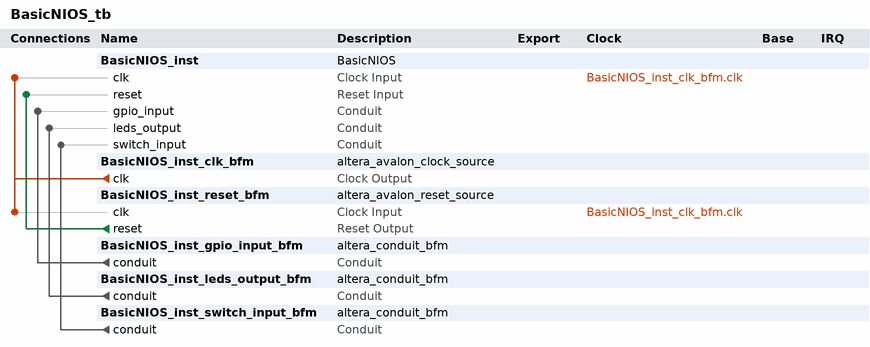
[diagram p0: system contents]
# Platform Designer (Qsys) system BasicNIOS_tb, Cyclone V 5CSEMA5F31C6
# Parameters at their usual value, and those the tool derives, are not listed.
package require -exact qsys 18.1
create_system BasicNIOS_tb
set_project_property DEVICE_FAMILY {Cyclone V}
set_project_property DEVICE 5CSEMA5F31C6

add_instance BasicNIOS_inst BasicNIOS 1.0

add_instance BasicNIOS_inst_clk_bfm altera_avalon_clock_source 18.1

add_instance BasicNIOS_inst_reset_bfm altera_avalon_reset_source 18.1
set_instance_parameter_value BasicNIOS_inst_reset_bfm ASSERT_HIGH_RESET 0
set_instance_parameter_value BasicNIOS_inst_reset_bfm INITIAL_RESET_CYCLES 50

add_instance BasicNIOS_inst_gpio_input_bfm altera_conduit_bfm 18.1
set_instance_parameter_value BasicNIOS_inst_gpio_input_bfm CLOCKED_SIGNAL false
set_instance_parameter_value BasicNIOS_inst_gpio_input_bfm ENABLE_RESET false
set_instance_parameter_value BasicNIOS_inst_gpio_input_bfm SIGNAL_DIRECTIONS output
set_instance_parameter_value BasicNIOS_inst_gpio_input_bfm SIGNAL_WIDTHS 4

add_instance BasicNIOS_inst_leds_output_bfm altera_conduit_bfm 18.1
set_instance_parameter_value BasicNIOS_inst_leds_output_bfm CLOCKED_SIGNAL false
set_instance_parameter_value BasicNIOS_inst_leds_output_bfm ENABLE_RESET false
set_instance_parameter_value BasicNIOS_inst_leds_output_bfm SIGNAL_DIRECTIONS input
set_instance_parameter_value BasicNIOS_inst_leds_output_bfm SIGNAL_WIDTHS 32

add_instance BasicNIOS_inst_switch_input_bfm altera_conduit_bfm 18.1
set_instance_parameter_value BasicNIOS_inst_switch_input_bfm CLOCKED_SIGNAL false
set_instance_parameter_value BasicNIOS_inst_switch_input_bfm ENABLE_RESET false
set_instance_parameter_value BasicNIOS_inst_switch_input_bfm SIGNAL_DIRECTIONS output
set_instance_parameter_value BasicNIOS_inst_switch_input_bfm SIGNAL_WIDTHS 10

# connections
add_connection BasicNIOS_inst_clk_bfm.clk BasicNIOS_inst.clk clock
add_connection BasicNIOS_inst_clk_bfm.clk BasicNIOS_inst_reset_bfm.clk clock
add_connection BasicNIOS_inst_reset_bfm.reset BasicNIOS_inst.reset reset
add_connection BasicNIOS_inst_gpio_input_bfm.conduit BasicNIOS_inst.gpio_input conduit
add_connection BasicNIOS_inst_leds_output_bfm.conduit BasicNIOS_inst.leds_output conduit
add_connection BasicNIOS_inst_switch_input_bfm.conduit BasicNIOS_inst.switch_input conduit

set_interconnect_requirement {$system} qsys_mm.clockCrossingAdapter HANDSHAKE
set_interconnect_requirement {$system} qsys_mm.enableEccProtection FALSE
set_interconnect_requirement {$system} qsys_mm.insertDefaultSlave FALSE
set_interconnect_requirement {$system} qsys_mm.maxAdditionalLatency 1

save_system BasicNIOS_tb.qsys
